# Altium schematic sheet 01_Power.SchDoc
size A3
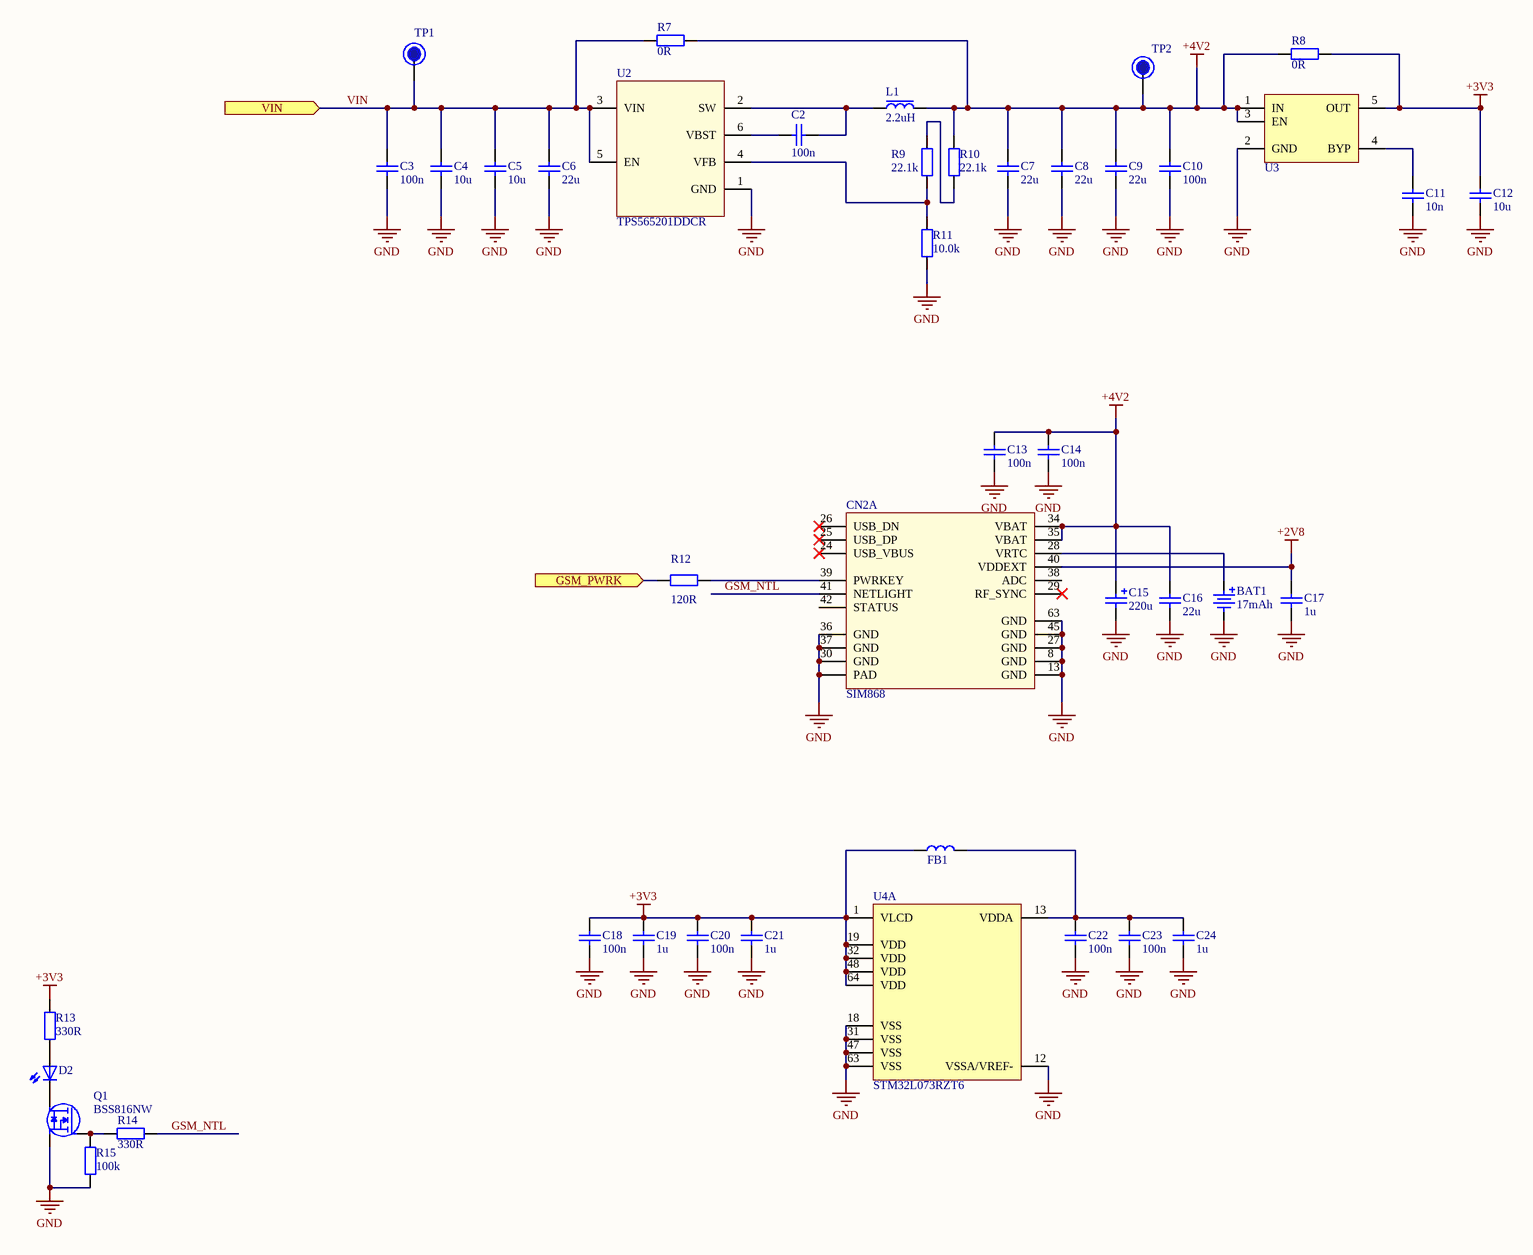
[diagram p0: 01_Power.SchDoc]

## Parts
BAT1  17mAh  [ML1220]
C2  100n  [C0603_IPC_MD]
C3  100n  [C0603_IPC_MD]
C4  10u  [C0805_IPC_MD]
C5  10u  [C0805_IPC_MD]
C6  22u  [C0805_IPC_MD]
C7  22u  [C0805_IPC_MD]
C8  22u  [C0805_IPC_MD]
C9  22u  [C0805_IPC_MD]
C10  100n  [C0603_IPC_MD]
C11  10n  [C0603_IPC_MD]
C12  10u  [C0805_IPC_MD]
C13  100n  [C0603_IPC_MD]
C14  100n  [C0603_IPC_MD]
C15  220u  [TANT_CAP_7343]
C16  22u  [C0805_IPC_MD]
C17  1u  [C0603_IPC_MD]
C18  100n  [C0603_IPC_MD]
C19  1u  [C0603_IPC_MD]
C20  100n  [C0603_IPC_MD]
C21  1u  [C0603_IPC_MD]
C22  100n  [C0603_IPC_MD]
C23  100n  [C0603_IPC_MD]
C24  1u  [C0603_IPC_MD]
CN2  SIM868  [SIM868]  (part A of 2)
D2  LTST-C190GKT  [LED_0603]  (value not drawn)
FB1  MH1608-601Y  [L0603_IPC_MD]  (value not drawn)
L1  2.2uH  [ASPI-0520LR]
Q1  BSS816NW  [SOT323]
R7  0R  [R0603_IPC_MD]  (no BOM)
R8  0R  [R0603_IPC_MD]  (no BOM)
R9  22.1k  [R0603_IPC_MD]
R10  22.1k  [R0603_IPC_MD]
R11  10.0k  [R0603_IPC_MD]
R12  120R  [R0603_IPC_MD]
R13  330R  [R0603_IPC_MD]
R14  330R  [R0603_IPC_MD]
R15  100k  [R0603_IPC_MD]
TP1  VIN  [TestPoint_1M5]  (value not drawn)  (no BOM)
TP2  4V2  [TestPoint_1M5]  (value not drawn)  (no BOM)
U2  TPS565201DDCR  [SOT23-6_(TI)]
U3  MIC5219-3.3YM5-TR  [SOT23-5_(MT)]  (value not drawn)
U4  STM32L073RZT6  [LQFP64_10X10MM]  (part A of 2)

## Ports
GSM_PWRK (in), VIN (in)

## Nets
+2V8: C17.2 CN2.40(VDDEXT)
+3V3: C12.2 C18.2 C19.2 C20.2 C21.2 FB1.1 R8.2 R13.2 U3.5(OUT) U4.1(VLCD) U4.19(VDD) U4.32(VDD) U4.48(VDD) U4.64(VDD)
+4V2: C7.1 C8.1 C9.1 C10.1 C13.2 C14.2 C15.1 C16.1 CN2.34(VBAT) CN2.35(VBAT) L1.2 R7.2 R8.1 R10.2 TP2.0 U3.1(IN) U3.3(EN)
GND: BAT1.2 C3.2 C4.1 C5.1 C6.2 C7.2 C8.2 C9.2 C10.2 C11.1 C12.1 C13.1 C14.1 C15.2 C16.2 C17.1 C18.1 C19.1 C20.1 C21.1 C22.1 C23.1 C24.1 CN2.8(GND) CN2.13(GND) CN2.27(GND) CN2.30(GND) CN2.36(GND) CN2.37(GND) CN2.45(GND) CN2.63(GND) CN2.PAD Q1.2(S) R11.1 R15.1 U2.1(GND) U3.2(GND) U4.12(VSSA/VREF-) U4.18(VSS) U4.31(VSS) U4.47(VSS) U4.63(VSS)
GSM_NTL: CN2.41(NETLIGHT) R14.2
GSM_PWRK: R12.1 ; port GSM_PWRK
VIN: C3.1 C4.2 C5.2 C6.1 R7.1 TP1.0 U2.3(VIN) U2.5(EN) ; port VIN
NetBAT1_1: BAT1.1 CN2.28(VRTC)
NetC2_1: C2.1 L1.1 U2.2(SW)
NetC2_2: C2.2 U2.6(VBST)
NetC11_2: C11.2 U3.4(BYP)
NetC22_2: C22.2 C23.2 C24.2 FB1.2 U4.13(VDDA)
NetCN2_39: CN2.39(PWRKEY) R12.2
NetD2_1: D2.1(C) Q1.3(D)
NetD2_2: D2.2(A) R13.1
NetQ1_1: Q1.1(G) R14.1 R15.2
NetR9_1: R9.1 R11.2 U2.4(VFB)
NetR9_2: R9.2 R10.1

Not connected (* = marked no-connect by the designer): CN2 24(USB_VBUS)* 25(USB_DP)* 26(USB_DN)* 29(RF_SYNC)* 38(ADC) 42(STATUS)

## Library data of the parts
BAT1 = ML1220: BATT LITH 3V 17MAH COIN 12.5MM; Manufacturer: CHINA; Manufacturer Part Number: ML1220; Value: 17mAh; Voltage: 3V; Supplier 1: Aliexpress; Supplier Part Number 1: ML1220
C2 C3 C10 = CL10B104KO8NNNC: CAP CER 0.1UF 16V X7R 0603; Manufacturer: Samsung Electro-Mechanics; Manufacturer Part Number: CL10B104KO8NNNC; Voltage: 16V; Value: 100n; Dielectric: X7R; Supplier 1: Digi-Key; Supplier Part Number 1: 1276-1005-1-ND
C4 C5 C12 = CL21B106KOQNNNG: CAP CER 10UF 16V X7R 0805; Manufacturer: Samsung Electro-Mechanics; Manufacturer Part Number: CL21B106KOQNNNG; Voltage: 16V; Value: 10u; Dielectric: X7R; Supplier 1: Digi-Key; Supplier Part Number 1: 1276-6472-1-ND
C6-C9 C16 = CL21A226MOCLRNC: CAP CER 22UF 16V X5R 0805; Manufacturer: Samsung Electro-Mechanics; Manufacturer Part Number: CL21A226MOCLRNC; Voltage: 16V; Value: 22u; Dielectric: X5R; Supplier 1: Digi-Key; Supplier Part Number 1: 1276-6780-1-ND
C11 = CL10B103KB8NNNC: CAP CER 0.01UF 50V X7R 0603; Manufacturer: Samsung Electro-Mechanics; Manufacturer Part Number: CL10B103KB8NNNC; Voltage: 50V; Value: 10n; Dielectric: X7R; Supplier 1: Digi-Key; Supplier Part Number 1: 1276-1009-1-ND
C13 C14 C18 C20 C22 C23 = CL10B104KO8WPNC: CAP CER 0.1UF 16V X7R 0603; Manufacturer: Samsung Electro-Mechanics; Manufacturer Part Number: CL10B104KO8WPNC; Voltage: 16V; Value: 100n; Dielectric: X7R; Supplier 1: Digi-Key; Supplier Part Number 1: 1276-6582-1-ND
C15 = 6TPE220MI: Tantalum Capacitors 220uF 6.3V CASE-D_7343 RoHS; Manufacturer: PANASONIC; Manufacturer Part Number: 6TPE220MI; Value: 220u; Voltage: 6.3V; Supplier 1: LCSC; Supplier Part Number 1: C129173
C17 C19 C21 C24 = CL10B105MO8NNWC: CAP CER 1UF 16V X7R 0603; Manufacturer: Samsung Electro-Mechanics; Manufacturer Part Number: CL10B105MO8NNWC; Voltage: 16V; Value: 1u; Dielectric: X7R; Supplier 1: Digi-Key; Supplier Part Number 1: 1276-6524-1-ND
CN2 = SIM868: GSM & GPRS & GPS Modules PCBModule RoHS; Manufacturer: SIMCom Wireless Solutions; Manufacturer Part Number: SIM868; Supplier 1: LCSC; Supplier Part Number 1: C89549
D2 = LTST-C190GKT: LED GREEN CLEAR CHIP SMD 0603; Manufacturer: Lite-On Inc.; Manufacturer Part Number: LTST-C190GKT; Color: Green; Supplier 1: Digi-Key; Supplier Part Number 1: 160-1183-1-ND
FB1 = MH1608-601Y: FERRITE BEAD 600R@100MHz 0603 for Power Line, 1000mA; Manufacturer: Bourns Inc.; Manufacturer Part Number: MH1608-601Y; Supplier 1: Digi-Key; Supplier Part Number 1: MH1608-601YCT-ND
L1 = ASPI-0520LR-2R2M-T2: FIXED IND 2.2UH 5.5A 36 MOHM SMD; Manufacturer: Abracon LLC; Manufacturer Part Number: ASPI-0520LR-2R2M-T2; Value: 2.2uH; Supplier 1: Digi-Key; Supplier Part Number 1: ASPI-0520LR-2R2M-T2CT-ND
Q1 = BSS816: N-Channel Logic Level Enhancement Mode Field Effect Transistor; Manufacturer: Infineon Technologies; Manufacturer Part Number: BSS816NW; Supplier 1: Digi-Key; Supplier Part Number 1: BSS816NWH6327XTSA1CT-ND
R7 R8 = CR0603-J/-000ELF: RES SMD 0 OHM JUMPER 1/10W 0603; Manufacturer: Bourns Inc.; Tolarance: 1%; Value: 0R; Manufacturer Part Number: CR0603-J/-000ELF; Supplier 1: Digi-Key; Supplier Part Number 1: CR0603-J/-000ELFCT-ND
R9 R10 = RC0603FR-0722K1L: RES SMD 22.1K OHM 1% 1/10W 0603; Manufacturer: Yageo; Value: 22.1k; Tolarance: 1%; Manufacturer Part Number: RC0603FR-0722K1L; Supplier 1: Digi-Key; Supplier Part Number 1: 311-22.1KHRCT-ND
R11 = RMCF0603FT10K0: RES 10K OHM 1% 1/10W 0603; Manufacturer: Stackpole Electronics Inc; Value: 10.0k; Tolarance: 1%; Manufacturer Part Number: RMCF0603FT10K0; Supplier 1: Digi-Key; Supplier Part Number 1: RMCF0603FT10K0CT-ND
R12 = RC0603JR-07120RL: RES SMD 120 OHM 5% 1/10W 0603; Manufacturer: Yageo; Value: 120R; Tolarance: 5%; Manufacturer Part Number: RC0603JR-07120RL; Supplier 1: Digi-Key; Supplier Part Number 1: 311-120GRCT-ND
R13 R14 = CR0603-JW-331ELF: RES SMD 330 OHM 5% 1/10W 0603; Manufacturer: Bourns Inc.; Value: 330R; Tolarance: 5%; Manufacturer Part Number: CR0603-JW-331ELF; Supplier 1: Digi-Key; Supplier Part Number 1: CR0603-JW-331ELFCT-ND
R15 = RMCF0603FT100K: RES 100K OHM 1% 1/10W 0603; Manufacturer: Bourns Inc.; Value: 100k; Tolarance: 1%; Manufacturer Part Number: RMCF0603FT100K; Supplier 1: Digi-Key; Supplier Part Number 1: RMCF0603FT100KCT-ND
TP1 TP2 = TP: Test Point
U2 = TPS565201DDCR: Buck Switching Regulator IC Positive Adjustable 0.76V 1 Output 5A SOT-23-6 Thin, TSOT-23-6; Manufacturer: TI; Manufacturer Part Number: TPS565201DDCR; Supplier 1: Digi-Key; Supplier Part Number 1: 296-49006-1-ND
U3 = MIC5219-3.3YM5-TR: IC REG LINEAR 3.3V 500MA SOT23-5; Manufacturer: Microchip Technology; Manufacturer Part Number: MIC5219-3.3YM5-TR; Supplier 1: Digi-Key; Supplier Part Number 1: 576-1281-1-ND
U4 = STM32L073RZT6: Ultra-low-power 32-bit MCU ARM®-based Cortex®-M0+; Manufacturer: ST; SRAM: 20KB; FLASH: 192KB; Manufacturer Part Number: STM32L073RZT6; Supplier 1: Digi-Key; Supplier Part Number 1: 497-16270-ND